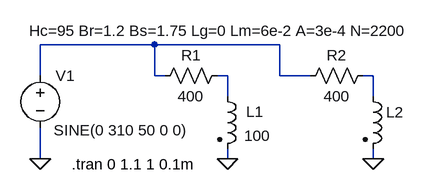
[diagram p0: schematic NL_induct.asc]
NL_induct.asc, the LTspice schematic file:
Version 4
SHEET 1 1000 680
WIRE 48 16 -128 16
WIRE 240 16 48 16
WIRE -128 64 -128 16
WIRE 48 64 48 16
WIRE 64 64 48 64
WIRE 160 64 144 64
WIRE 240 64 240 16
WIRE 288 64 240 64
WIRE 384 64 368 64
WIRE 160 96 160 64
WIRE 384 96 384 64
WIRE -128 192 -128 144
WIRE 160 192 160 176
WIRE 384 192 384 176
FLAG -128 192 0
FLAG 160 192 0
FLAG 384 192 0
SYMBOL ind2 144 80 R0
WINDOW 0 45 39 Left 0
WINDOW 3 42 76 Left 0
SYMATTR InstName L1
SYMATTR Value 100
SYMATTR Type ind
SYMBOL res 160 48 R90
WINDOW 0 0 56 VBottom 0
WINDOW 3 32 56 VTop 0
SYMATTR InstName R1
SYMATTR Value 400
SYMBOL voltage -128 48 R0
WINDOW 3 21 100 Left 0
WINDOW 123 0 0 Left 0
WINDOW 39 0 0 Left 0
SYMATTR Value SINE(0 310 50 0 0)
SYMATTR InstName V1
SYMBOL ind2 368 80 R0
WINDOW 3 -513 -85 Left 0
SYMATTR Value Hc=95 Br=1.2 Bs=1.75 Lg=0 Lm=6e-2 A=3e-4 N=2200
SYMATTR InstName L2
SYMATTR Type ind
SYMBOL res 384 48 R90
WINDOW 0 0 56 VBottom 0
WINDOW 3 32 56 VTop 0
SYMATTR InstName R2
SYMATTR Value 400
TEXT -80 200 Left 0 !.tran 0 1.1 1 0.1m

The netlist it stands for:
* NL_induct.asc
L1 N002 0 100
R1 N002 N001 400
V1 N001 0 SINE(0 310 50 0 0)
L2 N003 0 Hc=95 Br=1.2 Bs=1.75 Lg=0 Lm=6e-2 A=3e-4 N=2200
R2 N003 N001 400
.tran 0 1.1 1 0.1m
.backanno
.end